# EAGLE design rev1 (EAGLE 5.01)
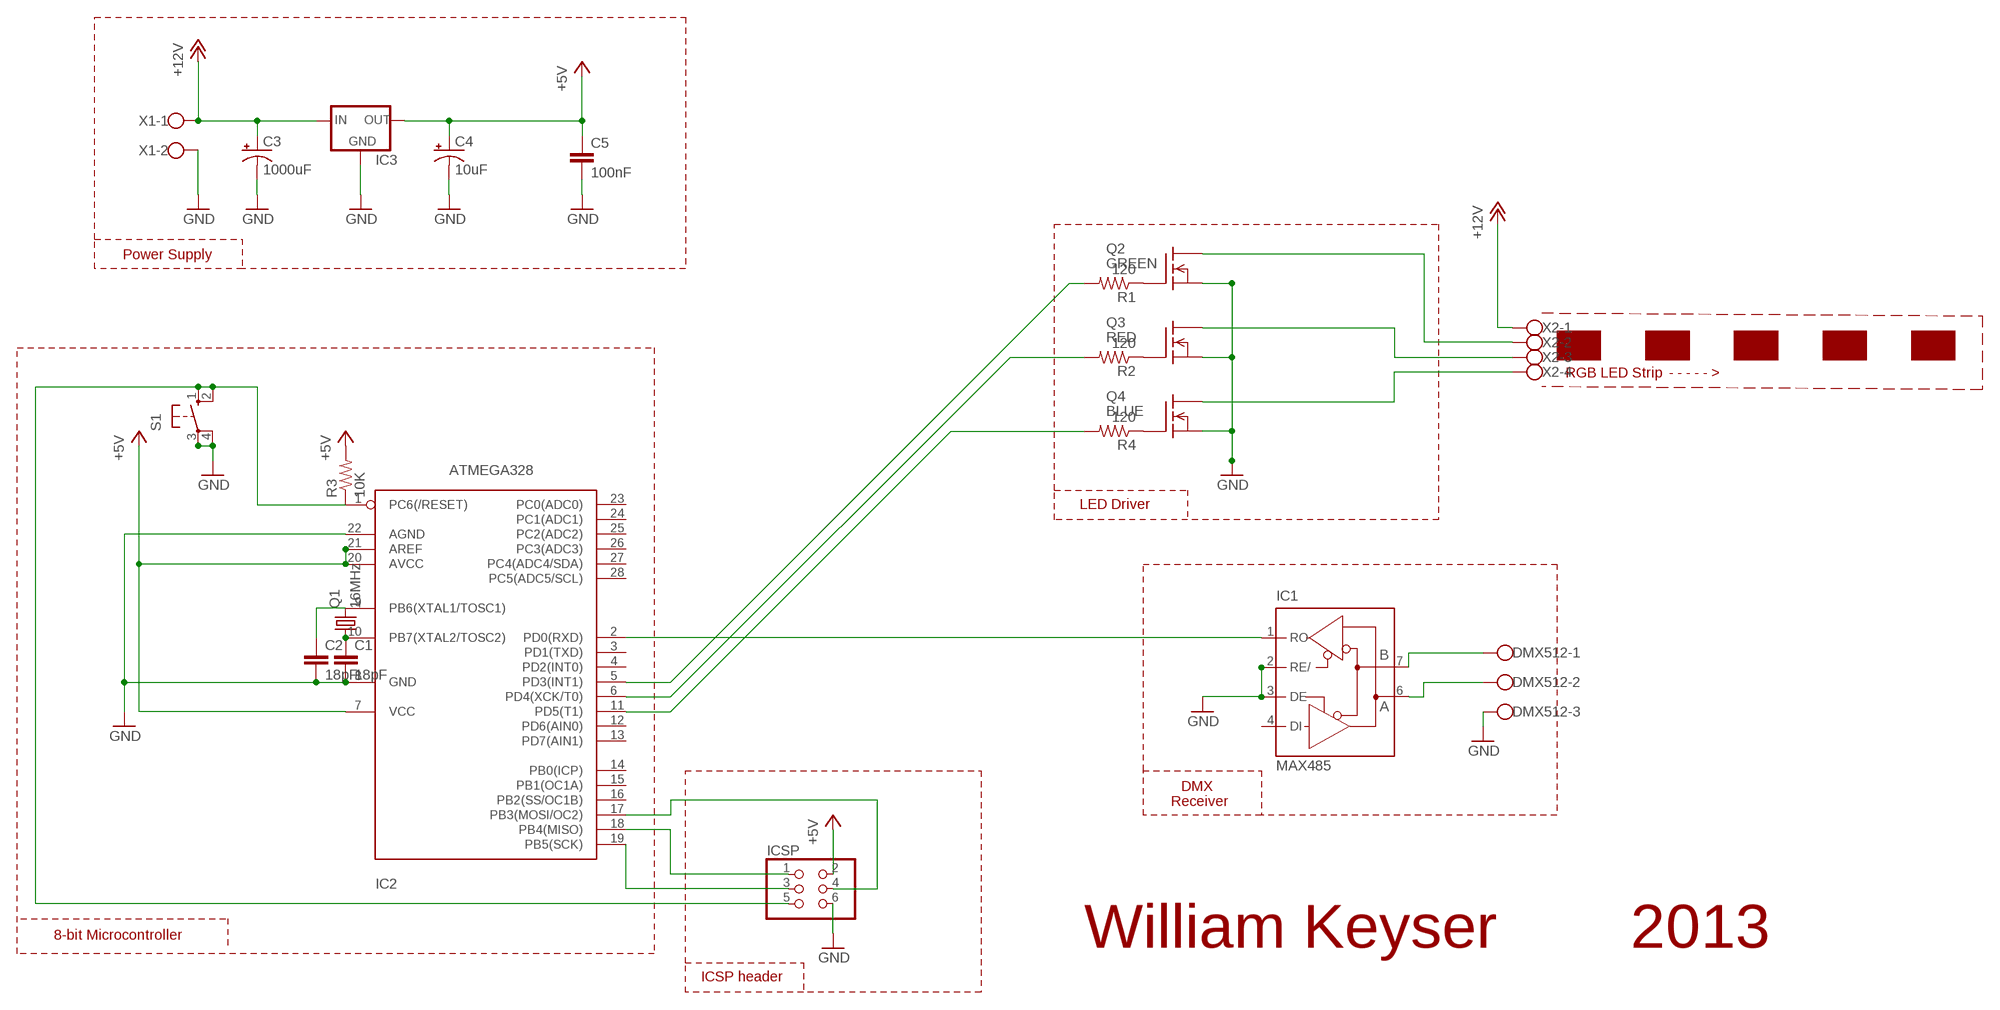
[diagram p0: schematic, sheet 1]

## Parts
C1  18pF  C2,5-3  [C2.5-3]
C2  18pF  C2,5-3  [C2.5-3]
C3  1000uF  CPOL-USE2-4  [E2-4]
C4  10uF  CPOL-USE2-4  [E2-4]
C5  100nF  C2,5-3  [C2.5-3]
DMX512  W237-103  [W237-103]
IC1  MAX485  MAX481CPA  [DIL08]
IC2  ATMEGA328  MEGA8-P  [DIL28-3]
IC3  78XXS  [78XXS]
ICSP  PINHD-2X3  [2X03]
Q1  16MHz  CRYSTALHC49S  [HC49/S]
Q2  GREEN  BUZ20  [TO220]
Q3  RED  BUZ20  [TO220]
Q4  BLUE  BUZ20  [TO220]
R1  120  R-US_0204/5  [0204/5]
R2  120  R-US_0204/5  [0204/5]
R3  10K  R-US_0204/5  [0204/5]
R4  120  R-US_0204/5  [0204/5]
S1  10-XX  [B3F-10XX]
X1  W237-102  [W237-102]
X2  W237-4  [W237-4]

## Nets
+5V: C4.+ C5.1 IC2.7(VCC) IC2.20(AVCC) IC2.21(AREF) IC3.OUT ICSP.2 R3.2
+12V: C3.+ IC3.IN X1.1 X2.1
GND: C1.2 C2.2 C3.- C4.- C5.2 DMX512.3 IC1.2(RE/) IC1.3(DE) IC2.8(GND) IC2.22(AGND) IC3.GND ICSP.6 Q2.3(S) Q3.3(S) Q4.3(S) S1.3(P) S1.4(P1) X1.2
N$1: DMX512.1 IC1.7(B)
N$2: DMX512.2 IC1.6(A)
N$3: IC1.1(RO) IC2.2(PD0(RXD))
N$4: C2.1 IC2.9(PB6(XTAL1/TOSC1)) Q1.2
N$5: C1.1 IC2.10(PB7(XTAL2/TOSC2)) Q1.1
N$6: IC2.1(PC6(/RESET)) ICSP.5 R3.1 S1.1(S) S1.2(S1)
N$7: IC2.17(PB3(MOSI/OC2)) ICSP.4
N$8: IC2.19(PB5(SCK)) ICSP.3
N$9: IC2.5(PD3(INT1)) R1.2
N$10: IC2.18(PB4(MISO)) ICSP.1
N$11: IC2.6(PD4(XCK/T0)) R2.2
N$12: IC2.11(PD5(T1)) R4.2
N$13: Q2.1(G) R1.1
N$15: Q3.1(G) R2.1
N$16: Q4.1(G) R4.1
N$17: Q3.2(D) X2.3
N$18: Q4.2(D) X2.4
N$19: Q2.2(D) X2.2
Unconnected: IC1.4(DI) IC2.3(PD1(TXD)) IC2.4(PD2(INT0)) IC2.12(PD6(AIN0)) IC2.13(PD7(AIN1)) IC2.14(PB0(ICP)) IC2.15(PB1(OC1A)) IC2.16(PB2(SS/OC1B)) IC2.23(PC0(ADC0)) IC2.24(PC1(ADC1)) IC2.25(PC2(ADC2)) IC2.26(PC3(ADC3)) IC2.27(PC4(ADC4/SDA)) IC2.28(PC5(ADC5/SCL))

## Notes on the sheet
- Power Supply
- RGB LED Strip | - - - - - >
- LED Driver
- DMX
- Receiver
- 8-bit Microcontroller
- William Keyser | 2013
- ICSP header

## Power pins joined to a net without a drawn wire
GND: IC1.5(GND)
VCC: IC1.8(VCC)

## Library data of the parts
C1 C2 C5 = capacitor-wima:C: CAPACITOR naming: grid - package width
C3 C4 = rcl:CPOL-US: POLARIZED CAPACITOR, American symbol
DMX512 = con-wago-500:W237-103: WAGO SCREW CLAMP
IC1 = maxim:MAX481CPA: RS485 TRANSEIVER
IC2 = atmel:MEGA8-P: MICROCONTROLLER 8 Kbytes FLASH, 1 kbytes SRAM, 512 bytes EEPROM, USART, 4-channel 10 bit ADC, 2-channel 8 bit ADC Pin compatible with Atmega48, ATMega88, ATMega168 Source: avr.lbr
IC3 = v-reg:78XXS: VOLTAGE REGULATOR
ICSP = pinhead:PINHD-2X3: PIN HEADER
Q1 = crystal:CRYSTAL: CRYSTAL
Q2-Q4 = transistor-fet:BUZ20: N-Channel Enhancement MOSFET 100V; 12A; 0,2Ohm
R1-R4 = rcl:R-US_: RESISTOR, American symbol
S1 = switch-omron:10-XX: OMRON SWITCH
X1 = con-wago-500:W237-102: WAGO SCREW CLAMP
X2 = con-wago-500:W237-4: WAGO SCREW CLAMP

## Board
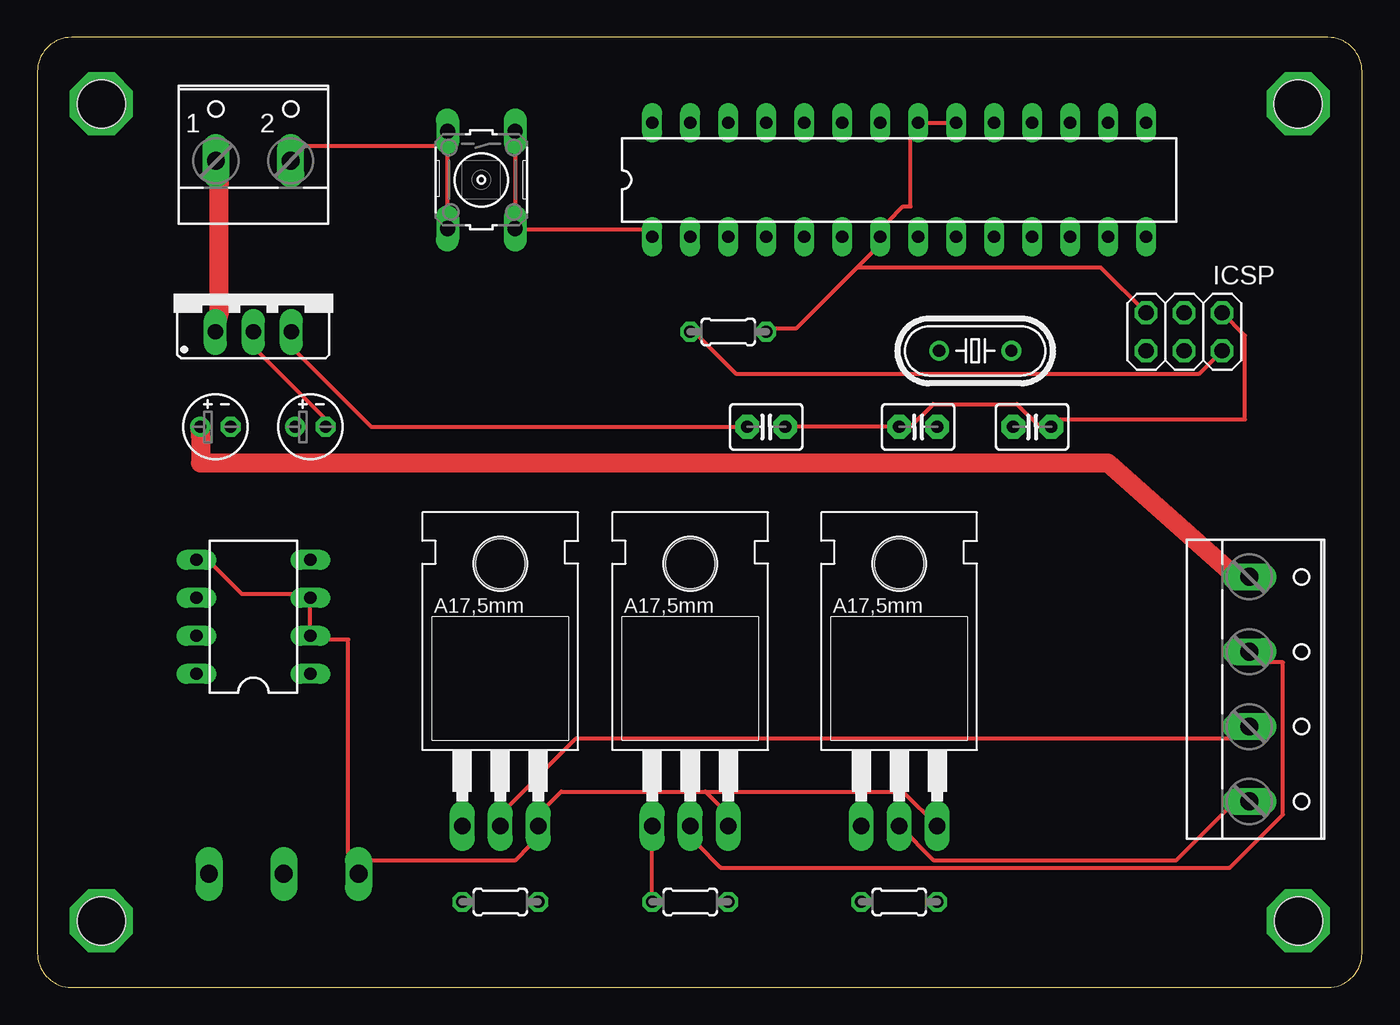
[diagram p1: board, top side]
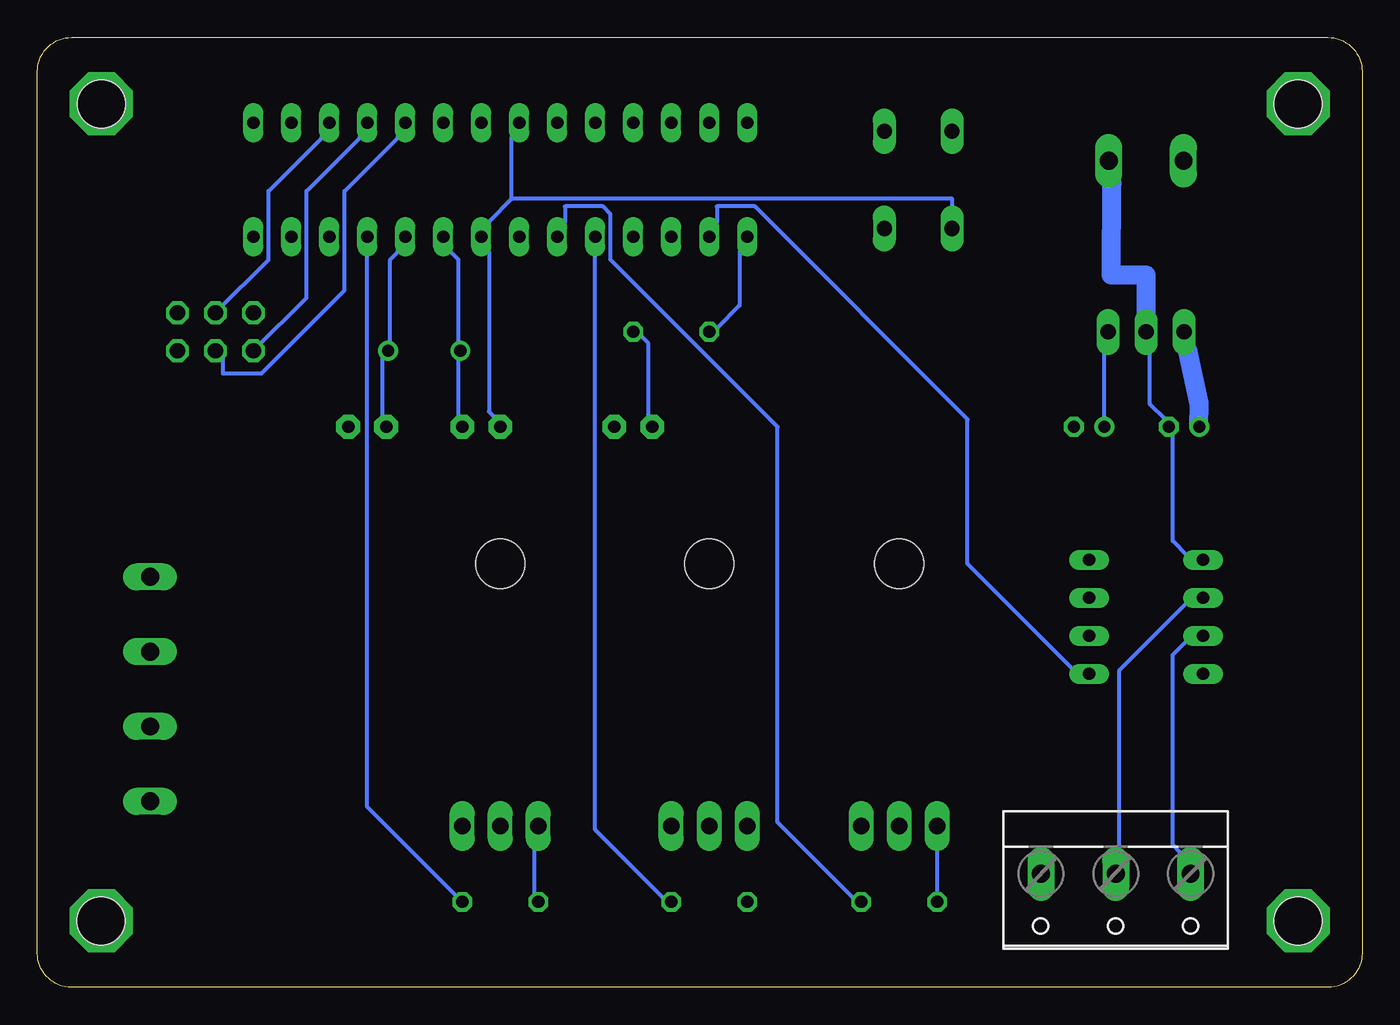
[diagram p2: board, bottom side, seen from below]

Size 88.57 x 63.49 mm. Coordinates in mm from the lower left corner, seen from the top.
Outline: 86.28,0 arc90 88.57,2.29 88.57,61.2 arc90 86.28,63.49 2.29,63.49 arc90 0,61.2 0,2.29 arc90 2.29,0 86.28,0
Copper layers (1*16): Top 0.035mm / dielectric 1.5mm / Bottom 0.035mm
Design rules "default": minimum track width 10mil, minimum drill 24mil, track to track 8mil, track to pad 8mil, pad to pad 8mil, via to via 8mil, smd to smd 8mil, copper to edge 40mil, drill to drill 8mil, minimum pad ring 10mil, minimum via ring 8mil, stop-mask expansion 4mil, vias tented up to drill 0mil, thermal gap 10mil
Holes 3.2 mm at 4.28,4.44 84.32,4.44 84.29,59.05 4.28,59.05

### Footprints (pad centres in the part's own frame; a part is rotated, then mirrored left to right if it is on the bottom)
C2.5-3 = drill 0.813 pad 1.6 octagon: 1 -1.27,0; 2 1.27,0
E2-4 = drill 0.813 pad 1.27 round: + -1.016,0 | drill 0.813 pad 1.27 octagon: - 1.016,0
W237-103 = drill 1.194 long: 1 -5,-1.29; 2 0,-1.29; 3 5,-1.29
DIL08 = drill 0.813 long: 1 -3.81,-3.81; 2 -1.27,-3.81; 3 1.27,-3.81; 4 3.81,-3.81; 5 3.81,3.81; 6 1.27,3.81; 7 -1.27,3.81; 8 -3.81,3.81
DIL28-3 = drill 0.813 long: 1 -16.51,-3.81; 2 -13.97,-3.81; 3 -11.43,-3.81; 4 -8.89,-3.81; 5 -6.35,-3.81; 6 -3.81,-3.81; 7 -1.27,-3.81; 8 1.27,-3.81; 9 3.81,-3.81; 10 6.35,-3.81; 11 8.89,-3.81; 12 11.43,-3.81; 13 13.97,-3.81; 14 16.51,-3.81; 15 16.51,3.81; 16 13.97,3.81; 17 11.43,3.81; 18 8.89,3.81; 19 6.35,3.81; 20 3.81,3.81; 21 1.27,3.81; 22 -1.27,3.81; 23 -3.81,3.81; 24 -6.35,3.81; 25 -8.89,3.81; 26 -11.43,3.81; 27 -13.97,3.81; 28 -16.51,3.81
78XXS = drill 1.016 long: GND 0,-2.54; IN -2.54,-2.54; OUT 2.54,-2.54
2X03 = drill 1.016 octagon: 1 -2.54,-1.27; 2 -2.54,1.27; 3 0,-1.27; 4 0,1.27; 5 2.54,-1.27; 6 2.54,1.27
HC49/S = drill 0.813 round: 1 -2.413,0; 2 2.413,0
TO220 = drill 1.118 long: 1 -2.54,-6.35; 2 0,-6.35; 3 2.54,-6.35 | hole 3.302: 0,11.176
0204/5 = drill 0.813 octagon: 1 -2.54,0; 2 2.54,0
B3F-10XX = drill 1.016 long: 1 -3.251,2.261; 2 3.251,2.261; 3 -3.251,-2.261; 4 3.251,-2.261
W237-102 = drill 1.194 long: 1 -2.5,-1.27; 2 2.5,-1.27
W237-4 = drill 1.194 long: 1 -7.5,-1.27; 2 -2.5,-1.27; 3 2.5,-1.27; 4 7.5,-1.27

### Placement (x,y rotation side)
C1  66.51,37.46 0 top
C2  58.89,37.46 180 top
C3  11.9,37.46 0 top
C4  18.25,37.46 0 top
C5  48.73,37.46 0 top
DMX512  16.47,6.29 180 bottom
IC1  14.44,24.76 90 top
IC2  57.62,53.97 0 top
IC3  14.44,46.35 0 top
ICSP  76.67,43.81 0 top
Q1  62.7,42.54 180 top
Q2  43.65,17.14 0 top
Q3  30.95,17.14 0 top
Q4  57.62,17.14 0 top
R1  43.65,5.71 0 top
R2  30.95,5.71 0 top
R3  46.19,43.81 0 top
R4  57.62,5.71 0 top
S1  29.68,53.97 270 top
X1  14.44,56.51 0 top
X2  82.31,19.93 270 top

### Tracks (layer width: path | path; a pad name or v marks a point on that pad's centre or on a via)
+5V
  Top 0.254: IC2.20 IC2.21 58.38,56.76 58.38,52.19 57.87,52.19 56.86,51.18 IC2.7 55.84,49.14 54.83,48.13 | 54.83,48.13 50.76,44.06 49.24,44.06 R3.2 | 54.83,48.13 71.08,48.13 ICSP.2 | IC3.OUT 17.23,42.54 22.31,37.46 C5.1
  Bottom 0.254: C4.+ 17.23,42.54 IC3.OUT | R3.2 48.22,43.56 47.71,43.05 47.71,37.97 C5.1
+12V
  Top 1.27: X1.1 12.15,53.72 12.15,45.08 IC3.IN | X2.1 79.72,27.81 71.56,35.05 10.91,35.05 10.91,36.82 C3.+
  Bottom 0.254: C3.+ 10.91,37.51 | 11.65,42.54 IC3.IN
  Bottom 1.27: 10.91,37.51 10.88,39.01 11.65,42.54
GND
  Top 0.254: ICSP.6 80.73,43.56 80.73,37.97 68.03,37.97 C1.2 67.02,37.46 65.49,38.98 59.91,38.98 58.38,37.46 C2.2 C5.2 | 44.67,13.08 45.68,12.06 Q2.3 | 44.67,13.08 35.01,13.08 34,12.06 Q3.3 32.98,9.52 31.97,8.5 22.31,8.5 DMX512.3 20.79,9.01 20.79,23.24 19.27,23.24 IC1.2 IC1.3 17.23,26.28 13.68,26.28 11.65,28.32 IC1.5 | 44.67,13.08 57.87,13.08 Q4.3 | S1.4 27.39,52.19 27.39,55.75 S1.3 26.89,56.26 17.74,56.26 X1.2 | C4.- 19.27,37.97 14.69,42.54 IC3.GND
  Bottom 0.254: 56.86,52.7 58.38,51.18 IC2.8 58.38,49.14 58.38,38.48 57.87,37.97 C2.2 | 56.86,52.7 56.86,56.76 IC2.22 | IC3.GND 14.19,42.54 14.19,38.98 13.17,37.97 C3.- 12.66,36.95 12.66,29.84 11.65,28.82 IC1.5 | 56.86,52.7 27.39,52.7 27.39,52.19 S1.4
  Bottom 1.27: X1.2 16.73,53.72 16.78,47.59 14.44,47.59 IC3.GND
N$1
  Bottom 0.254: IC1.7 11.65,23.24 12.66,22.22 12.66,9.52 12.15,9.01 DMX512.1
N$2
  Bottom 0.254: IC1.6 11.65,25.78 16.22,21.2 16.22,9.01 DMX512.2
N$3
  Bottom 0.254: IC1.1 19.27,21.2 26.38,28.32 26.38,37.97 40.6,52.19 43.14,52.19 43.14,51.18 IC2.2
N$4
  Bottom 0.254: C2.1 60.41,37.97 60.41,42.03 Q1.2 60.41,43.05 60.41,48.64 60.92,49.14 IC2.9
N$5
  Bottom 0.254: C1.1 65.49,37.97 65.49,42.03 Q1.1 64.99,43.05 64.99,48.64 64.48,49.14 IC2.10
N$6
  Top 0.254: S1.1 31.97,55.75 31.97,52.19 S1.2 32.47,50.67 40.6,50.67 IC2.1 | ICSP.5 77.69,41.02 46.7,41.02 44.16,43.56 R3.1
  Bottom 0.254: R3.1 43.14,44.06 41.62,45.59 41.62,49.14 IC2.1
N$7
  Bottom 0.254: IC2.17 69.56,56.76 73.11,53.21 73.11,48.64 ICSP.4
N$8
  Bottom 0.254: IC2.19 64.48,56.76 68.03,53.21 68.03,46.6 73.62,41.02 76.16,41.02 76.16,42.03 ICSP.3
N$9
  Bottom 0.254: R1.2 46.7,5.96 51.27,10.54 IC2.5
N$10
  Bottom 0.254: IC2.18 67.02,56.76 70.57,53.21 70.57,46.1 ICSP.1
N$11
  Bottom 0.254: R2.2 34,5.96 39.08,11.04 39.08,37.46 50.25,48.64 50.25,51.68 50.76,52.19 53.3,52.19 53.3,51.18 IC2.6
N$12
  Bottom 0.254: R4.2 66.51,12.06 IC2.11
N$13
  Top 0.254: R1.1 Q2.1
N$14  (via drill 3.2)
  other vias: 84.29,59.05
N$15
  Bottom 0.254: R2.1 Q3.1
N$16
  Bottom 0.254: R4.1 55.33,5.96 55.33,9.52 Q4.1
N$17
  Top 0.254: Q3.2 31.46,12.06 36.03,16.63 79.72,16.63 X2.3
N$18
  Top 0.254: Q4.2 59.91,8.5 76.16,8.5 79.72,12.06 X2.4
N$19
  Top 0.254: Q2.2 44.16,9.52 45.68,8 79.72,8 83.27,11.55 83.27,21.71 82.26,21.71 X2.2
N$20  (via drill 3.2)
  other vias: 4.28,59.05
N$21  (via drill 3.2)
  other vias: 4.28,4.44
N$22  (via drill 3.2)
  other vias: 84.29,4.44

### Text on the board
tValues: + | - | Reset | +12VDC | William Keyser | 2013 - 2014 | 12V | OUT | RED | GREEN | BLUE | DMX